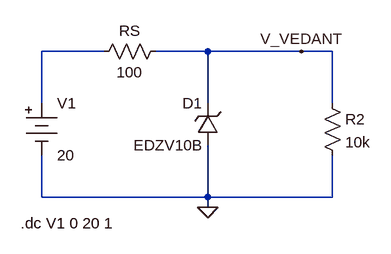
[diagram p0: schematic Draft34.asc]
Draft34.asc, the LTspice schematic file:
Version 4
SHEET 1 880 680
WIRE 32 80 -64 80
WIRE 192 80 112 80
WIRE 336 80 192 80
WIRE 384 80 336 80
WIRE -64 160 -64 80
WIRE 192 160 192 80
WIRE 384 160 384 80
WIRE -64 304 -64 240
WIRE 192 304 192 224
WIRE 192 304 -64 304
WIRE 384 304 384 240
WIRE 384 304 192 304
WIRE 192 320 192 304
FLAG 192 320 0
FLAG 336 80 V_VEDANT
SYMBOL zener 208 224 R180
WINDOW 0 24 64 Left 2
WINDOW 3 24 0 Left 2
SYMATTR InstName D1
SYMATTR Value EDZV10B
SYMBOL res 128 64 R90
WINDOW 0 0 56 VBottom 2
WINDOW 3 32 56 VTop 2
SYMATTR InstName RS
SYMATTR Value 100
SYMBOL res 368 144 R0
SYMATTR InstName R2
SYMATTR Value 10k
SYMBOL Misc\\battery -64 144 R0
WINDOW 123 0 0 Left 0
WINDOW 39 0 0 Left 0
SYMATTR InstName V1
SYMATTR Value 20
TEXT -96 344 Left 2 !.dc V1 0 20 1

The netlist it stands for:
* Draft34.asc
D1 0 V_VEDANT EDZV10B
RS V_VEDANT N001 100
R2 V_VEDANT 0 10k
V1 N001 0 20
.model D D
.lib standard.dio
.dc V1 0 20 1
.backanno
.end